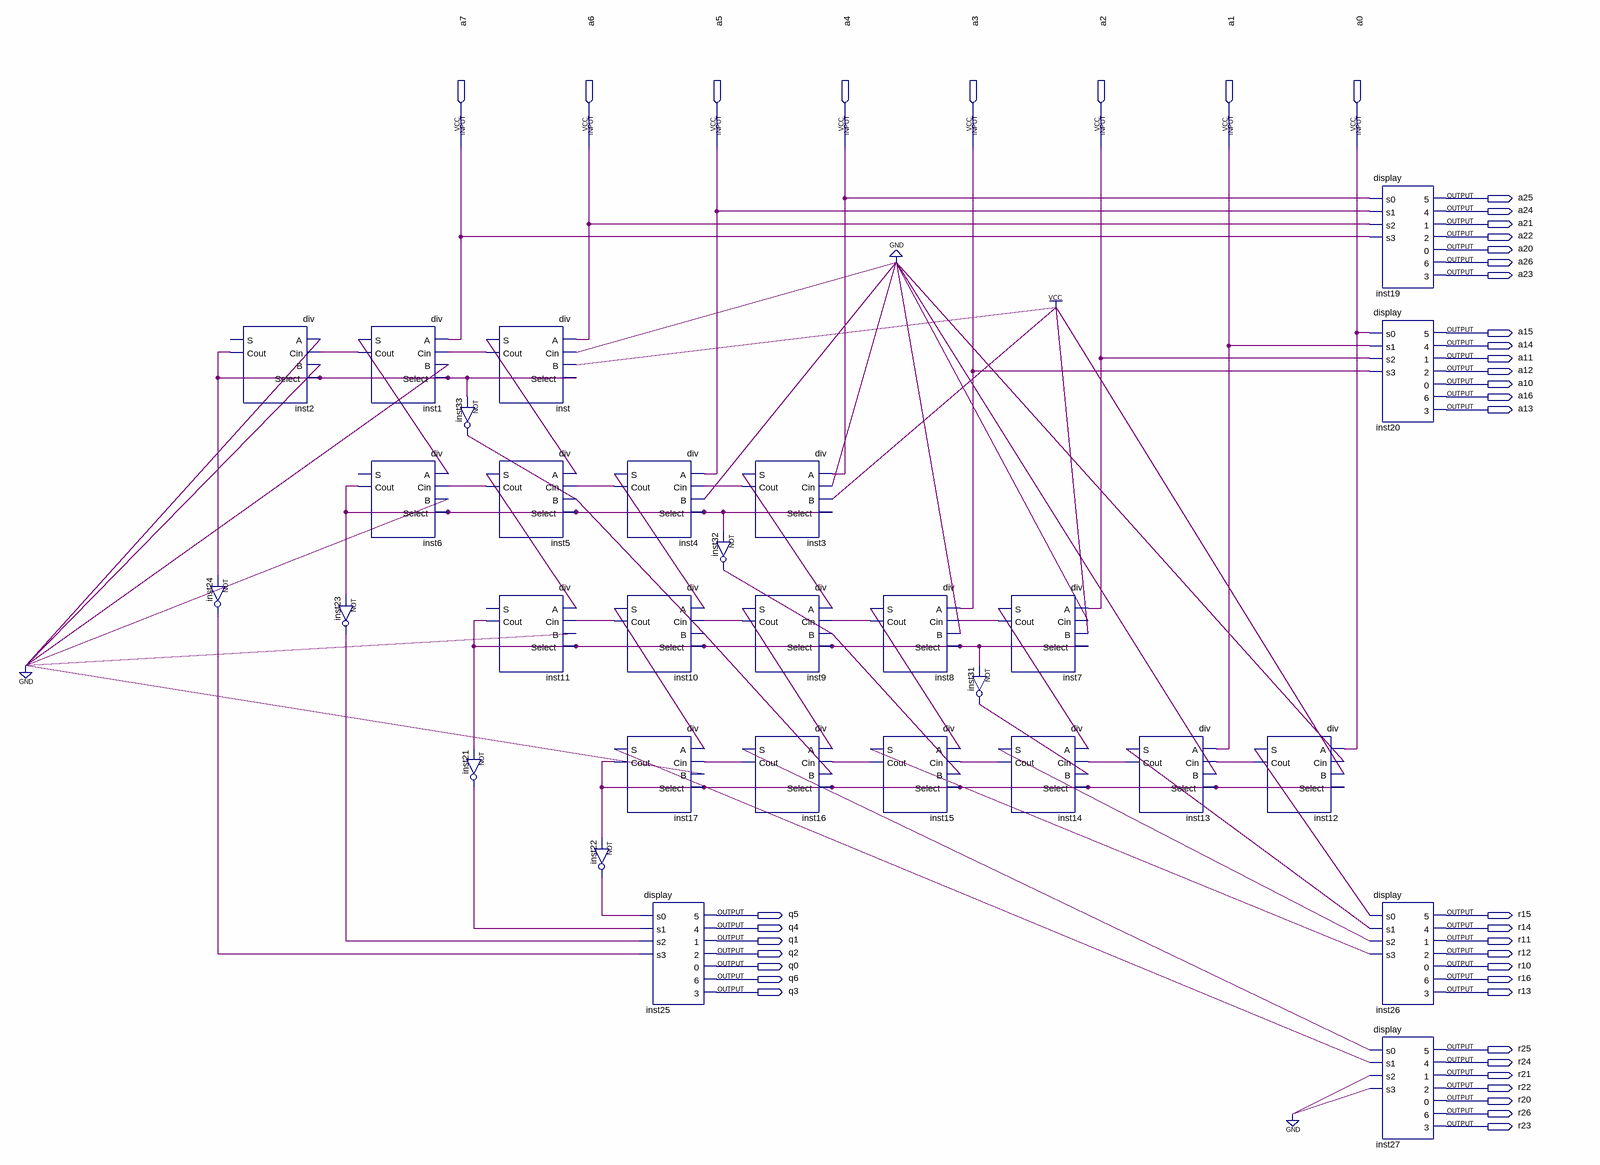
[diagram p0: schematic sheet]
// Quartus schematic rzqd.bdf as structural Verilog: 30 symbols, 43 pins
module rzqd (
  input  a7,
  input  a6,
  input  a5,
  input  a4,
  input  a3,
  input  a2,
  input  a1,
  input  a0,
  output a25,
  output a24,
  output a21,
  output a22,
  output a20,
  output a26,
  output a23,
  output a15,
  output a14,
  output a11,
  output a12,
  output a10,
  output a16,
  output a13,
  output q5,
  output r15,
  output q4,
  output r14,
  output q1,
  output r11,
  output q2,
  output r12,
  output q0,
  output r10,
  output q6,
  output r16,
  output q3,
  output r13,
  output r25,
  output r24,
  output r21,
  output r22,
  output r20,
  output r26,
  output r23
);

  wire inst1_cout, inst1_s, inst2_cout, inst3_cout, inst3_s, inst4_cout, inst4_s, inst5_cout, inst5_s,
       inst6_cout, inst7_cout, inst7_s, inst8_cout, inst8_s, inst9_cout, inst9_s, inst10_cout, inst10_s,
       inst11_cout, inst12_cout, inst12_s, inst13_cout, inst13_s, inst14_cout, inst14_s, inst15_cout,
       inst15_s, inst16_cout, inst16_s, inst17_cout, inst17_s, inst21_out, inst22_out, inst23_out,
       inst24_out, inst31_out, inst32_out, inst33_out, inst_cout, inst_s;

  not inst24 (inst24_out, inst2_cout);
  div inst2 (.A(1'b0), .Cin(inst1_cout), .B(1'b0), .Select(inst2_cout), .Cout(inst2_cout));  // open: S
  div inst1 (.A(a7), .Cin(inst_cout), .B(1'b0), .Select(inst2_cout), .S(inst1_s), .Cout(inst1_cout));
  div inst6 (.A(inst1_s), .Cin(inst5_cout), .B(1'b0), .Select(inst6_cout), .Cout(inst6_cout));  // open: S
  not inst23 (inst23_out, inst6_cout);
  not inst33 (inst33_out, inst2_cout);
  not inst21 (inst21_out, inst11_cout);
  div inst (.A(a6), .Cin(1'b0), .B(1'b1), .Select(inst2_cout), .S(inst_s), .Cout(inst_cout));
  div inst5 (.A(inst_s), .Cin(inst4_cout), .B(inst33_out), .Select(inst6_cout), .S(inst5_s), .Cout(inst5_cout));
  div inst11 (.A(inst5_s), .Cin(inst10_cout), .B(1'b0), .Select(inst11_cout), .Cout(inst11_cout));  // open: S
  div inst4 (.A(a5), .Cin(inst3_cout), .B(1'b0), .Select(inst6_cout), .S(inst4_s), .Cout(inst4_cout));
  div inst10 (.A(inst4_s), .Cin(inst9_cout), .B(inst33_out), .Select(inst11_cout), .S(inst10_s), .Cout(inst10_cout));
  div inst17 (.A(inst10_s), .Cin(inst16_cout), .B(1'b0), .Select(inst17_cout), .S(inst17_s), .Cout(inst17_cout));
  not inst22 (inst22_out, inst17_cout);
  display inst25 (
    .s0(inst22_out), .s1(inst21_out), .s2(inst23_out), .s3(inst24_out), .\5 (q5), .\4 (q4), .\1 (q1),
    .\2 (q2), .\0 (q0), .\6 (q6), .\3 (q3));
  not inst32 (inst32_out, inst6_cout);
  div inst3 (.A(a4), .Cin(1'b0), .B(1'b1), .Select(inst6_cout), .S(inst3_s), .Cout(inst3_cout));
  div inst9 (.A(inst3_s), .Cin(inst8_cout), .B(inst32_out), .Select(inst11_cout), .S(inst9_s), .Cout(inst9_cout));
  div inst16 (.A(inst9_s), .Cin(inst15_cout), .B(inst33_out), .Select(inst17_cout), .S(inst16_s), .Cout(inst16_cout));
  div inst8 (.A(a3), .Cin(inst7_cout), .B(1'b0), .Select(inst11_cout), .S(inst8_s), .Cout(inst8_cout));
  div inst15 (.A(inst8_s), .Cin(inst14_cout), .B(inst32_out), .Select(inst17_cout), .S(inst15_s), .Cout(inst15_cout));
  not inst31 (inst31_out, inst11_cout);
  div inst7 (.A(a2), .Cin(1'b0), .B(1'b1), .Select(inst11_cout), .S(inst7_s), .Cout(inst7_cout));
  div inst14 (.A(inst7_s), .Cin(inst13_cout), .B(inst31_out), .Select(inst17_cout), .S(inst14_s), .Cout(inst14_cout));
  div inst13 (.A(a1), .Cin(inst12_cout), .B(1'b0), .Select(inst17_cout), .S(inst13_s), .Cout(inst13_cout));
  div inst12 (.A(a0), .Cin(1'b0), .B(1'b1), .Select(inst17_cout), .S(inst12_s), .Cout(inst12_cout));
  display inst19 (
    .s0(a4), .s1(a5), .s2(a6), .s3(a7), .\5 (a25), .\4 (a24), .\1 (a21), .\2 (a22), .\0 (a20), .\6 (a26),
    .\3 (a23));
  display inst20 (
    .s0(a0), .s1(a1), .s2(a2), .s3(a3), .\5 (a15), .\4 (a14), .\1 (a11), .\2 (a12), .\0 (a10), .\6 (a16),
    .\3 (a13));
  display inst26 (
    .s0(inst12_s), .s1(inst13_s), .s2(inst14_s), .s3(inst15_s), .\5 (r15), .\4 (r14), .\1 (r11), .\2 (r12),
    .\0 (r10), .\6 (r16), .\3 (r13));
  display inst27 (
    .s0(inst16_s), .s1(inst17_s), .s2(1'b0), .s3(1'b0), .\5 (r25), .\4 (r24), .\1 (r21), .\2 (r22),
    .\0 (r20), .\6 (r26), .\3 (r23));
endmodule
